# Altium schematic sheet Block_Diagram.SchDoc: Block Diagram
size Letter; Organization: Midnight Sun Solar Rayce Car Team; Address1: University of Waterloo; Address2: 200 University Ave W; Address3: Waterloo, ON, Canada; Address4: N2L 3E9; DocumentNumber: 1; SheetNumber: 1; SheetTotal: 5; Website: www.uwmidsun.com
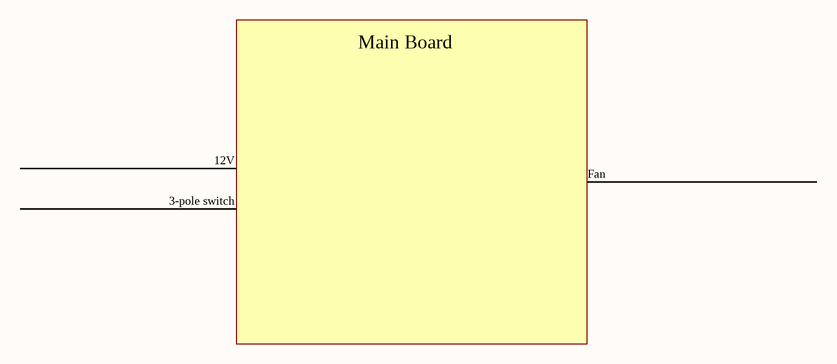
[diagram p0: Block_Diagram.SchDoc]

## Notes on the sheet
- Main Board
- 12V
- 3-pole switch
- Fan
- Project:
- Title:
- Size:
- Project Lead:
- Letter
- Revision:
- University of Waterloo
- 200 University Ave W
- Waterloo, ON, Canada
- N2L 3E9
- Date:
- Sheet
- of
- Website: